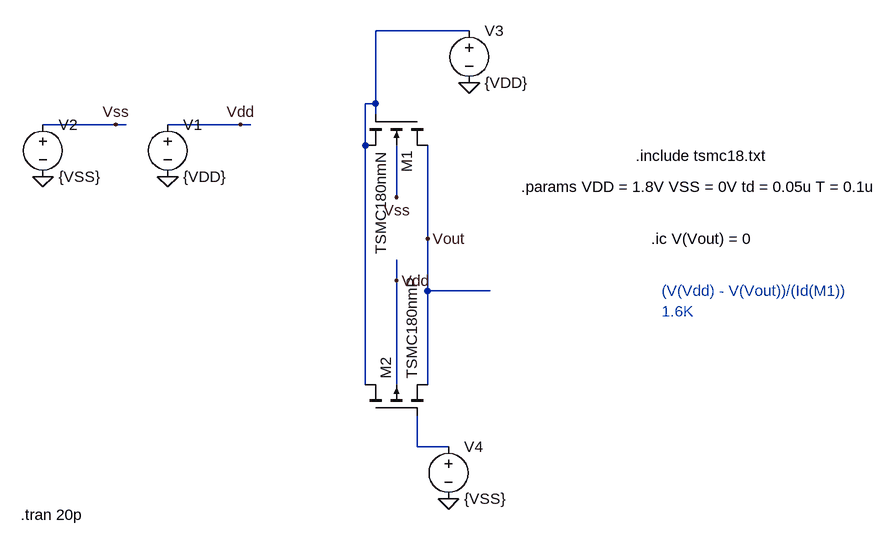
[diagram p0: schematic Tgate_resistance.asc]
Tgate_resistance.asc, the LTspice schematic file:
Version 4
SHEET 1 936 680
WIRE 272 -240 128 -240
WIRE 128 -128 128 -240
WIRE 128 -128 112 -128
WIRE 128 -112 128 -128
WIRE -272 -96 -384 -96
WIRE -256 -96 -272 -96
WIRE -80 -96 -192 -96
WIRE -64 -96 -80 -96
WIRE 112 -64 112 -128
WIRE 160 16 160 -64
WIRE 208 80 208 -64
WIRE 160 144 160 112
WIRE 208 160 208 80
WIRE 304 160 208 160
WIRE 112 304 112 -64
WIRE 160 304 160 144
WIRE 208 304 208 160
WIRE 192 400 192 352
WIRE 240 400 192 400
FLAG 160 144 Vdd
FLAG 160 16 Vss
FLAG -192 -16 0
FLAG -80 -96 Vdd
FLAG -384 -16 0
FLAG -272 -96 Vss
FLAG 240 480 0
FLAG 272 -160 0
FLAG 208 80 Vout
SYMBOL nmos4 208 -112 R90
SYMATTR InstName M1
SYMATTR Value TSMC180nmN
SYMATTR Value2 l=.18u w=3u
SYMBOL pmos4 112 352 R270
SYMATTR InstName M2
SYMATTR Value TSMC180nmP
SYMATTR Value2 l=.18u w=8u
SYMBOL voltage -192 -112 R0
WINDOW 123 0 0 Left 0
WINDOW 39 0 0 Left 0
SYMATTR InstName V1
SYMATTR Value {VDD}
SYMBOL voltage -384 -112 R0
WINDOW 123 0 0 Left 0
WINDOW 39 0 0 Left 0
SYMATTR InstName V2
SYMATTR Value {VSS}
SYMBOL voltage 272 -256 R0
WINDOW 123 0 0 Left 0
WINDOW 39 0 0 Left 0
SYMATTR InstName V3
SYMATTR Value {VDD}
SYMBOL voltage 240 384 R0
WINDOW 123 0 0 Left 0
WINDOW 39 0 0 Left 0
SYMATTR InstName V4
SYMATTR Value {VSS}
TEXT 528 -48 Left 2 !.include tsmc18.txt
TEXT 352 0 Left 2 !.params VDD = 1.8V VSS = 0V td = 0.05u T = 0.1u
TEXT 552 80 Left 2 !.ic V(Vout) = 0
TEXT -418 504 Left 2 !.tran 20p
TEXT 568 160 Left 2 ;(V(Vdd) - V(Vout))/(Id(M1))\n1.6K

The netlist it stands for:
* Tgate_resistance.asc
M1 Vout N001 N001 Vss TSMC180nmN l=.18u w=3u
M2 N001 N002 Vout Vdd TSMC180nmP l=.18u w=8u
V1 Vdd 0 {VDD}
V2 Vss 0 {VSS}
V3 N001 0 {VDD}
V4 N002 0 {VSS}
.model NMOS NMOS
.model PMOS PMOS
.lib standard.mos
.include tsmc18.txt
.params VDD = 1.8V VSS = 0V td = 0.05u T = 0.1u
.ic V(Vout) = 0
.tran 20p
* (V(Vdd) - V(Vout))/(Id(M1))
* 1.6K
.backanno
.end